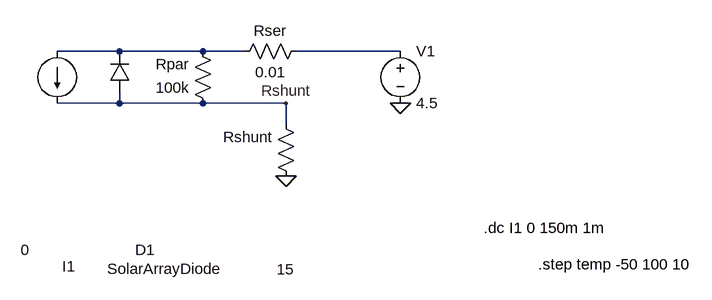
[diagram p0: schematic simple model.asc]
simple model.asc, the LTspice schematic file:
Version 4
SHEET 1 2604 2436
WIRE -384 576 -480 576
WIRE -256 576 -384 576
WIRE -192 576 -256 576
WIRE 48 576 -112 576
WIRE -384 656 -384 640
WIRE -384 656 -480 656
WIRE -256 656 -384 656
WIRE -128 656 -256 656
WIRE -128 688 -128 656
FLAG 48 656 0
FLAG -128 768 0
FLAG -128 656 Rshunt
SYMBOL current -480 576 R0
WINDOW 0 8 331 Left 2
WINDOW 3 -56 306 Left 2
WINDOW 123 0 0 Left 2
WINDOW 39 0 0 Left 2
SYMATTR InstName I1
SYMATTR Value 0
SYMBOL diode -368 640 R180
WINDOW 3 -142 -271 Left 2
WINDOW 0 -39 -242 Left 2
SYMATTR Value SolarArrayDiode
SYMATTR InstName D1
SYMBOL res -240 672 R180
WINDOW 0 36 76 Left 2
WINDOW 3 36 40 Left 2
SYMATTR InstName Rpar
SYMATTR Value 100k
SYMBOL res -96 560 R90
WINDOW 0 0 56 VBottom 2
WINDOW 3 32 56 VTop 2
SYMATTR InstName Rser
SYMATTR Value 0.01
SYMBOL voltage 48 560 R0
WINDOW 123 0 0 Left 2
WINDOW 39 0 0 Left 2
SYMATTR InstName V1
SYMATTR Value 4.5
SYMBOL res -112 784 R180
WINDOW 0 36 76 Left 2
WINDOW 3 3 -128 Left 2
SYMATTR InstName Rshunt
SYMATTR Value 15
TEXT 496 904 Right 2 !.step temp -50 100 10
TEXT 176 848 Left 2 !.dc I1 0 150m 1m

The netlist it stands for:
* simple model.asc
I1 N001 Rshunt 0
D1 Rshunt N001 SolarArrayDiode
Rpar Rshunt N001 100k
Rser N002 N001 0.01
V1 N002 0 4.5
Rshunt 0 Rshunt 15
.model D D
.lib standard.dio
.step temp -50 100 10
.dc I1 0 150m 1m
.backanno
.end